# EAGLE schematic real (EAGLE 9.3.0)
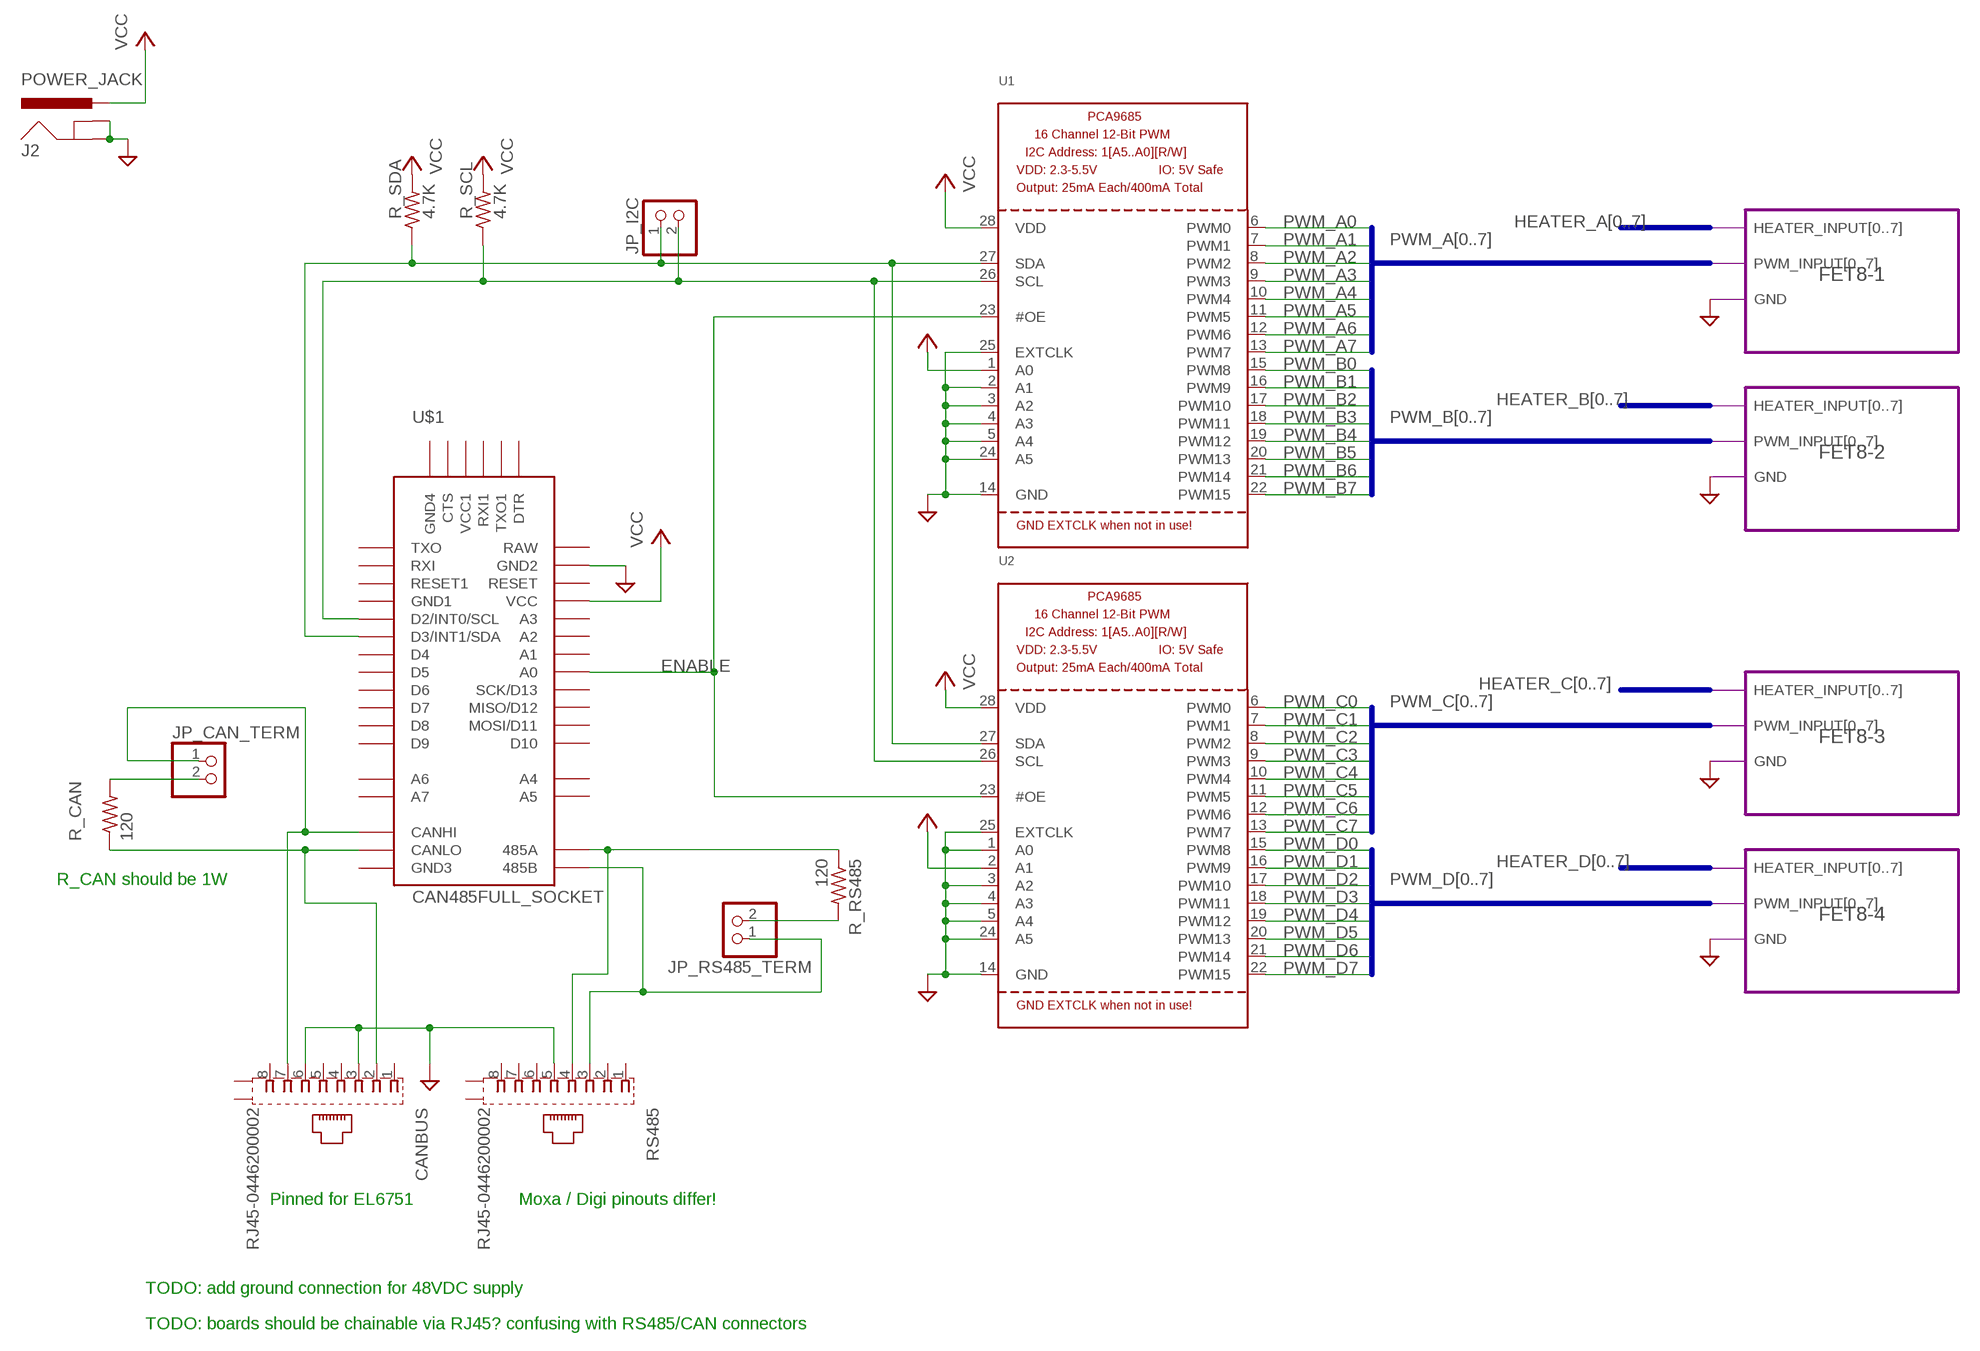
[diagram p0: schematic, sheet 1]

## Parts
CANBUS  RJ45-0446200002  [0446200002]
J2  POWER_JACK  [POWER_JACK_PTH]
JP_CAN_TERM  PINHD-1X2  [1X02]
JP_I2C  PINHD-1X2  [1X02]
JP_RS485_TERM  PINHD-1X2  [1X02]
R_CAN  120  R-US_0207/12  [0207/12]
R_RS485  120  R-US_0207/12  [0207/12]
R_SCL  4.7K  R-US_0207/12  [0207/12]
R_SDA  4.7K  R-US_0207/12  [0207/12]
RS485  RJ45-0446200002  [0446200002]
U1  PCA9685  [TSSOP28]
U2  PCA9685  [TSSOP28]
U$1  CAN485FULL_SOCKET  [CAN485]

## Module instances
FET8-1 = FET8
FET8-2 = FET8
FET8-3 = FET8
FET8-4 = FET8

## Nets
ENABLE: U1.23(#OE) U2.23(#OE) U$1.A0
GND: CANBUS.3 CANBUS.6 J2.GND J2.GNDBREAK RS485.5 U1.2(A1) U1.3(A2) U1.4(A3) U1.5(A4) U1.14(GND) U1.24(A5) U1.25(EXTCLK) U2.1(A0) U2.3(A2) U2.4(A3) U2.5(A4) U2.14(GND) U2.24(A5) U2.25(EXTCLK) U$1.GND2 ; port FET8-1.GND FET8-2.GND FET8-3.GND FET8-4.GND
N$1: JP_CAN_TERM.2 R_CAN.2
N$3: CANBUS.7 JP_CAN_TERM.1 U$1.CANHI
N$4: CANBUS.2 R_CAN.1 U$1.CANLO
N$5: R_RS485.1 RS485.4 U$1.485A
N$6: JP_RS485_TERM.2 R_RS485.2
N$7: JP_RS485_TERM.1 RS485.3 U$1.485B
N$16: JP_I2C.2 R_SCL.1 U1.26(SCL) U2.26(SCL) U$1.2(D2/INT0/SCL)
N$19: JP_I2C.1 R_SDA.1 U1.27(SDA) U2.27(SDA) U$1.3(D3/INT1/SDA)
PWM_A0: U1.6(PWM0)
PWM_A1: U1.7(PWM1)
PWM_A2: U1.8(PWM2)
PWM_A3: U1.9(PWM3)
PWM_A4: U1.10(PWM4)
PWM_A5: U1.11(PWM5)
PWM_A6: U1.12(PWM6)
PWM_A7: U1.13(PWM7)
PWM_B0: U1.15(PWM8)
PWM_B1: U1.16(PWM9)
PWM_B2: U1.17(PWM10)
PWM_B3: U1.18(PWM11)
PWM_B4: U1.19(PWM12)
PWM_B5: U1.20(PWM13)
PWM_B6: U1.21(PWM14)
PWM_B7: U1.22(PWM15)
PWM_C0: U2.6(PWM0)
PWM_C1: U2.7(PWM1)
PWM_C2: U2.8(PWM2)
PWM_C3: U2.9(PWM3)
PWM_C4: U2.10(PWM4)
PWM_C5: U2.11(PWM5)
PWM_C6: U2.12(PWM6)
PWM_C7: U2.13(PWM7)
PWM_D0: U2.15(PWM8)
PWM_D1: U2.16(PWM9)
PWM_D2: U2.17(PWM10)
PWM_D3: U2.18(PWM11)
PWM_D4: U2.19(PWM12)
PWM_D5: U2.20(PWM13)
PWM_D6: U2.21(PWM14)
PWM_D7: U2.22(PWM15)
VCC: J2.PWR R_SCL.2 R_SDA.2 U1.1(A0) U1.28(VDD) U2.2(A1) U2.28(VDD) U$1.VCC
Unconnected: CANBUS.1 CANBUS.4 CANBUS.5 CANBUS.8 CANBUS.S@1(S1) CANBUS.S@2(S2) RS485.1 RS485.2 RS485.6 RS485.7 RS485.8 RS485.S@1(S1) RS485.S@2(S2) U$1.4(D4) U$1.5(D5) U$1.6(D6) U$1.7(D7) U$1.8(D8) U$1.9(D9) U$1.10(D10) U$1.11(MOSI/D11) U$1.12(MISO/D12) U$1.13(SCK/D13) U$1.A1 U$1.A2 U$1.A3 U$1.A4 U$1.A5 U$1.A6 U$1.A7 U$1.CTS U$1.DTR U$1.GND1 U$1.GND3 U$1.GND4 U$1.RAW U$1.RST1(RESET1) U$1.RST(RESET) U$1.RXI U$1.RXI1 U$1.TXO U$1.TXO1 U$1.VCC1

## Buses
HEATER_A[0..7]
PWM_A[0..7]
HEATER_B[0..7]
PWM_B[0..7]
HEATER_C[0..7]
PWM_C[0..7]
HEATER_D[0..7]
PWM_D[0..7]

## Notes on the sheet
- R_CAN should be 1W
- Pinned for EL6751 | Moxa / Digi pinouts differ!
- TODO: add ground connection for 48VDC supply
- TODO: boards should be chainable via RJ45? confusing with RS485/CAN connectors

## Library data of the parts
CANBUS RS485 = real_library:RJ45-0446200002: RJ-45 INVERTED MODULAR JACK ASSEMBLY WITH RJ-11 KEEPOUT FEATURE Source: Data sheet <http://www.farnell.com/datasheets/73207.pdf> MOLEX 0446200002 BUCHSE, RJ45, GESCHIRMT Source: Farnell <http://de.farnell.com/molex/0446200002/buchse-rj45-geschirmt/dp/9251910?ost=9251910>; MF: MOLEX; MPN: 0446200002; OC_FARNELL: 9251910
J2 = real_library:POWER_JACK: Power Jack Connector This is the standard 5.5mm barrel jack for power. The PTH is the most common, proven, reliable, footprint. The Slot footprint only works if the mill layer is transmitted to the PCB fab house so be warned. Here are the connectors we sell at SparkFun: DC Barrel Power Jack/Connector <https://www.sparkfun.com/products/119> (PRT-00119) DC Barrel Power Jack/Connector (SMD) <https://www.sparkfun.com/products/12748> (PRT-12748) DC Barrel Jack Adapter - Breadboard Compatible <https://www.sparkfun.com/products/10811> (PRT-10811) It is used on this SparkFun product (and many, many others): SparkFun RedBoard - Programmed with Arduino <https://www.sparkfun.com/products/12757> (DEV-12757) Also, if you need a mating power supply or connector, please check these out: Wall Adapter Power Supply - 9VDC 650mA <https://www.sparkfun.com/products/298> (TOL-00298) DC Barrel Jack Adapter - Male <https://www.sparkfun.com/products/10287> (PRT-10287); PROD_ID: CONN-08197
JP_CAN_TERM JP_I2C JP_RS485_TERM = pinhead:PINHD-1X2: PIN HEADER
R_CAN R_RS485 R_SCL R_SDA = rcl:R-US_: RESISTOR, American symbol; SPICEPREFIX: 120
U1 U2 = real_library:PCA9685: PCA9685 - 16 Channel 12-Bit I2C PWM Controller 5.0V tolerant 16 channel, 12-bit I2C PWM controller with 25mA per output (max. 400mA total) Digikey: 568-5931-1-ND
U$1 = real_library:CAN485

## Module FET8
Ports: HEATER_INPUT[0..7](io) PWM_INPUT[0..7](io) GND(io)
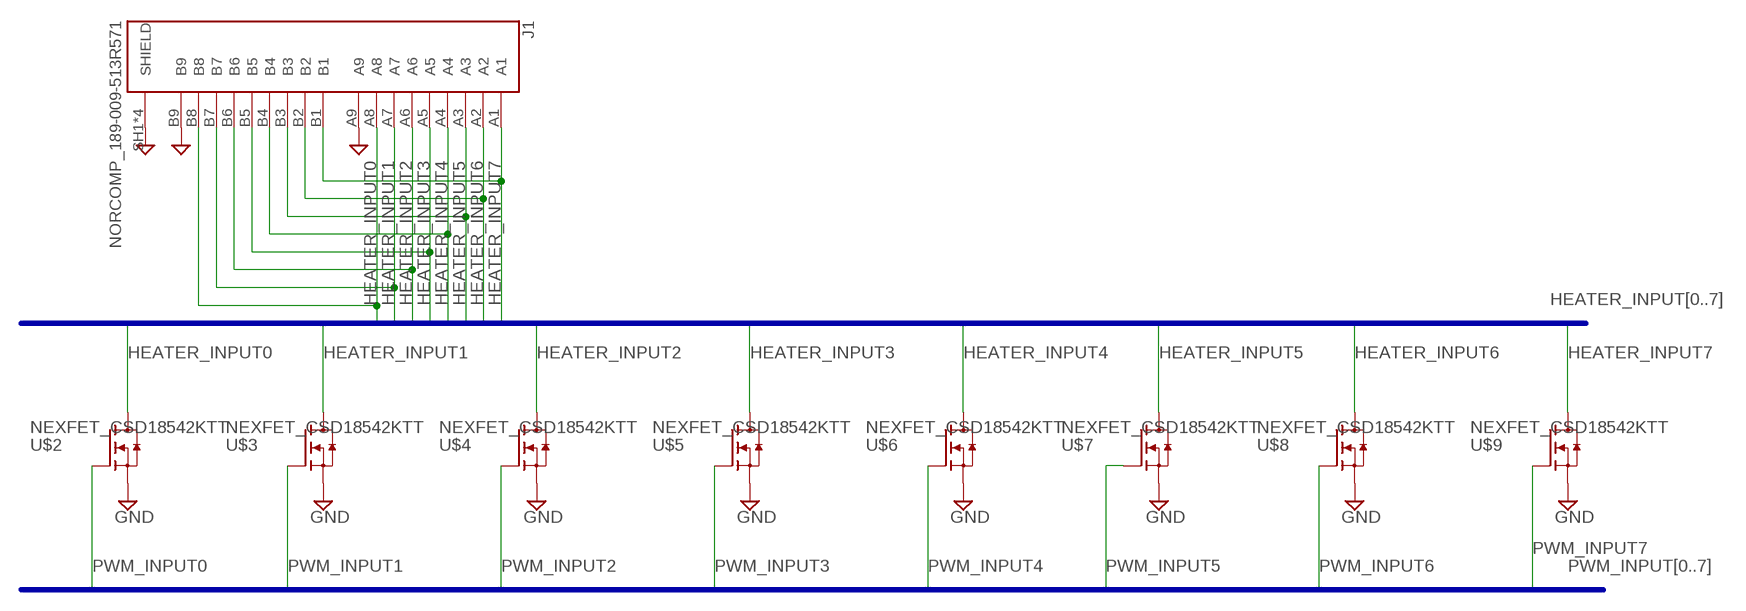
[diagram p1: schematic, module FET8, sheet 1]

### Parts
J1  NORCOMP_189-009-513R571  [NORCOMP_189-009-513R571]
U$2  NEXFET_CSD18542KTT  [D2PAK-KTT]
U$3  NEXFET_CSD18542KTT  [D2PAK-KTT]
U$4  NEXFET_CSD18542KTT  [D2PAK-KTT]
U$5  NEXFET_CSD18542KTT  [D2PAK-KTT]
U$6  NEXFET_CSD18542KTT  [D2PAK-KTT]
U$7  NEXFET_CSD18542KTT  [D2PAK-KTT]
U$8  NEXFET_CSD18542KTT  [D2PAK-KTT]
U$9  NEXFET_CSD18542KTT  [D2PAK-KTT]

### Nets
GND: J1.A9 J1.B9 J1.SH1(SHIELD) J1.SH2(SHIELD) J1.SH3(SHIELD) J1.SH4(SHIELD) U$2.3(S) U$3.3(S) U$4.3(S) U$5.3(S) U$6.3(S) U$7.3(S) U$8.3(S) U$9.3(S)
HEATER_INPUT0: J1.A8 J1.B8 U$2.2(D)
HEATER_INPUT1: J1.A7 J1.B7 U$3.2(D)
HEATER_INPUT2: J1.A6 J1.B6 U$4.2(D)
HEATER_INPUT3: J1.A5 J1.B5 U$5.2(D)
HEATER_INPUT4: J1.A4 J1.B4 U$6.2(D)
HEATER_INPUT5: J1.A3 J1.B3 U$7.2(D)
HEATER_INPUT6: J1.A2 J1.B2 U$8.2(D)
HEATER_INPUT7: J1.A1 J1.B1 U$9.2(D)
PWM_INPUT0: U$2.1(G)
PWM_INPUT1: U$3.1(G)
PWM_INPUT2: U$4.1(G)
PWM_INPUT3: U$5.1(G)
PWM_INPUT4: U$6.1(G)
PWM_INPUT5: U$7.1(G)
PWM_INPUT6: U$8.1(G)
PWM_INPUT7: U$9.1(G)

### Buses
PWM_INPUT[0..7]
HEATER_INPUT[0..7]

### Library data of the parts
J1 = real_library:NORCOMP_189-009-513R571: CONN D-SUB RCPT 9POS R/A SLDR; AVAILABILITY: Unavailable; DESCRIPTION: Conn D-Subminiature F/F 9/9 POS 2.77mm Solder RA Thru-Hole 18 Terminal 2 Port; MF: NorComp Inc.; MP: 189-009-513R571; PACKAGE: None; PRICE: None
U$2-U$9 = real_library:NEXFET_CSD18542KTT